# Altium project STM32-MiniPi.PrjPcb
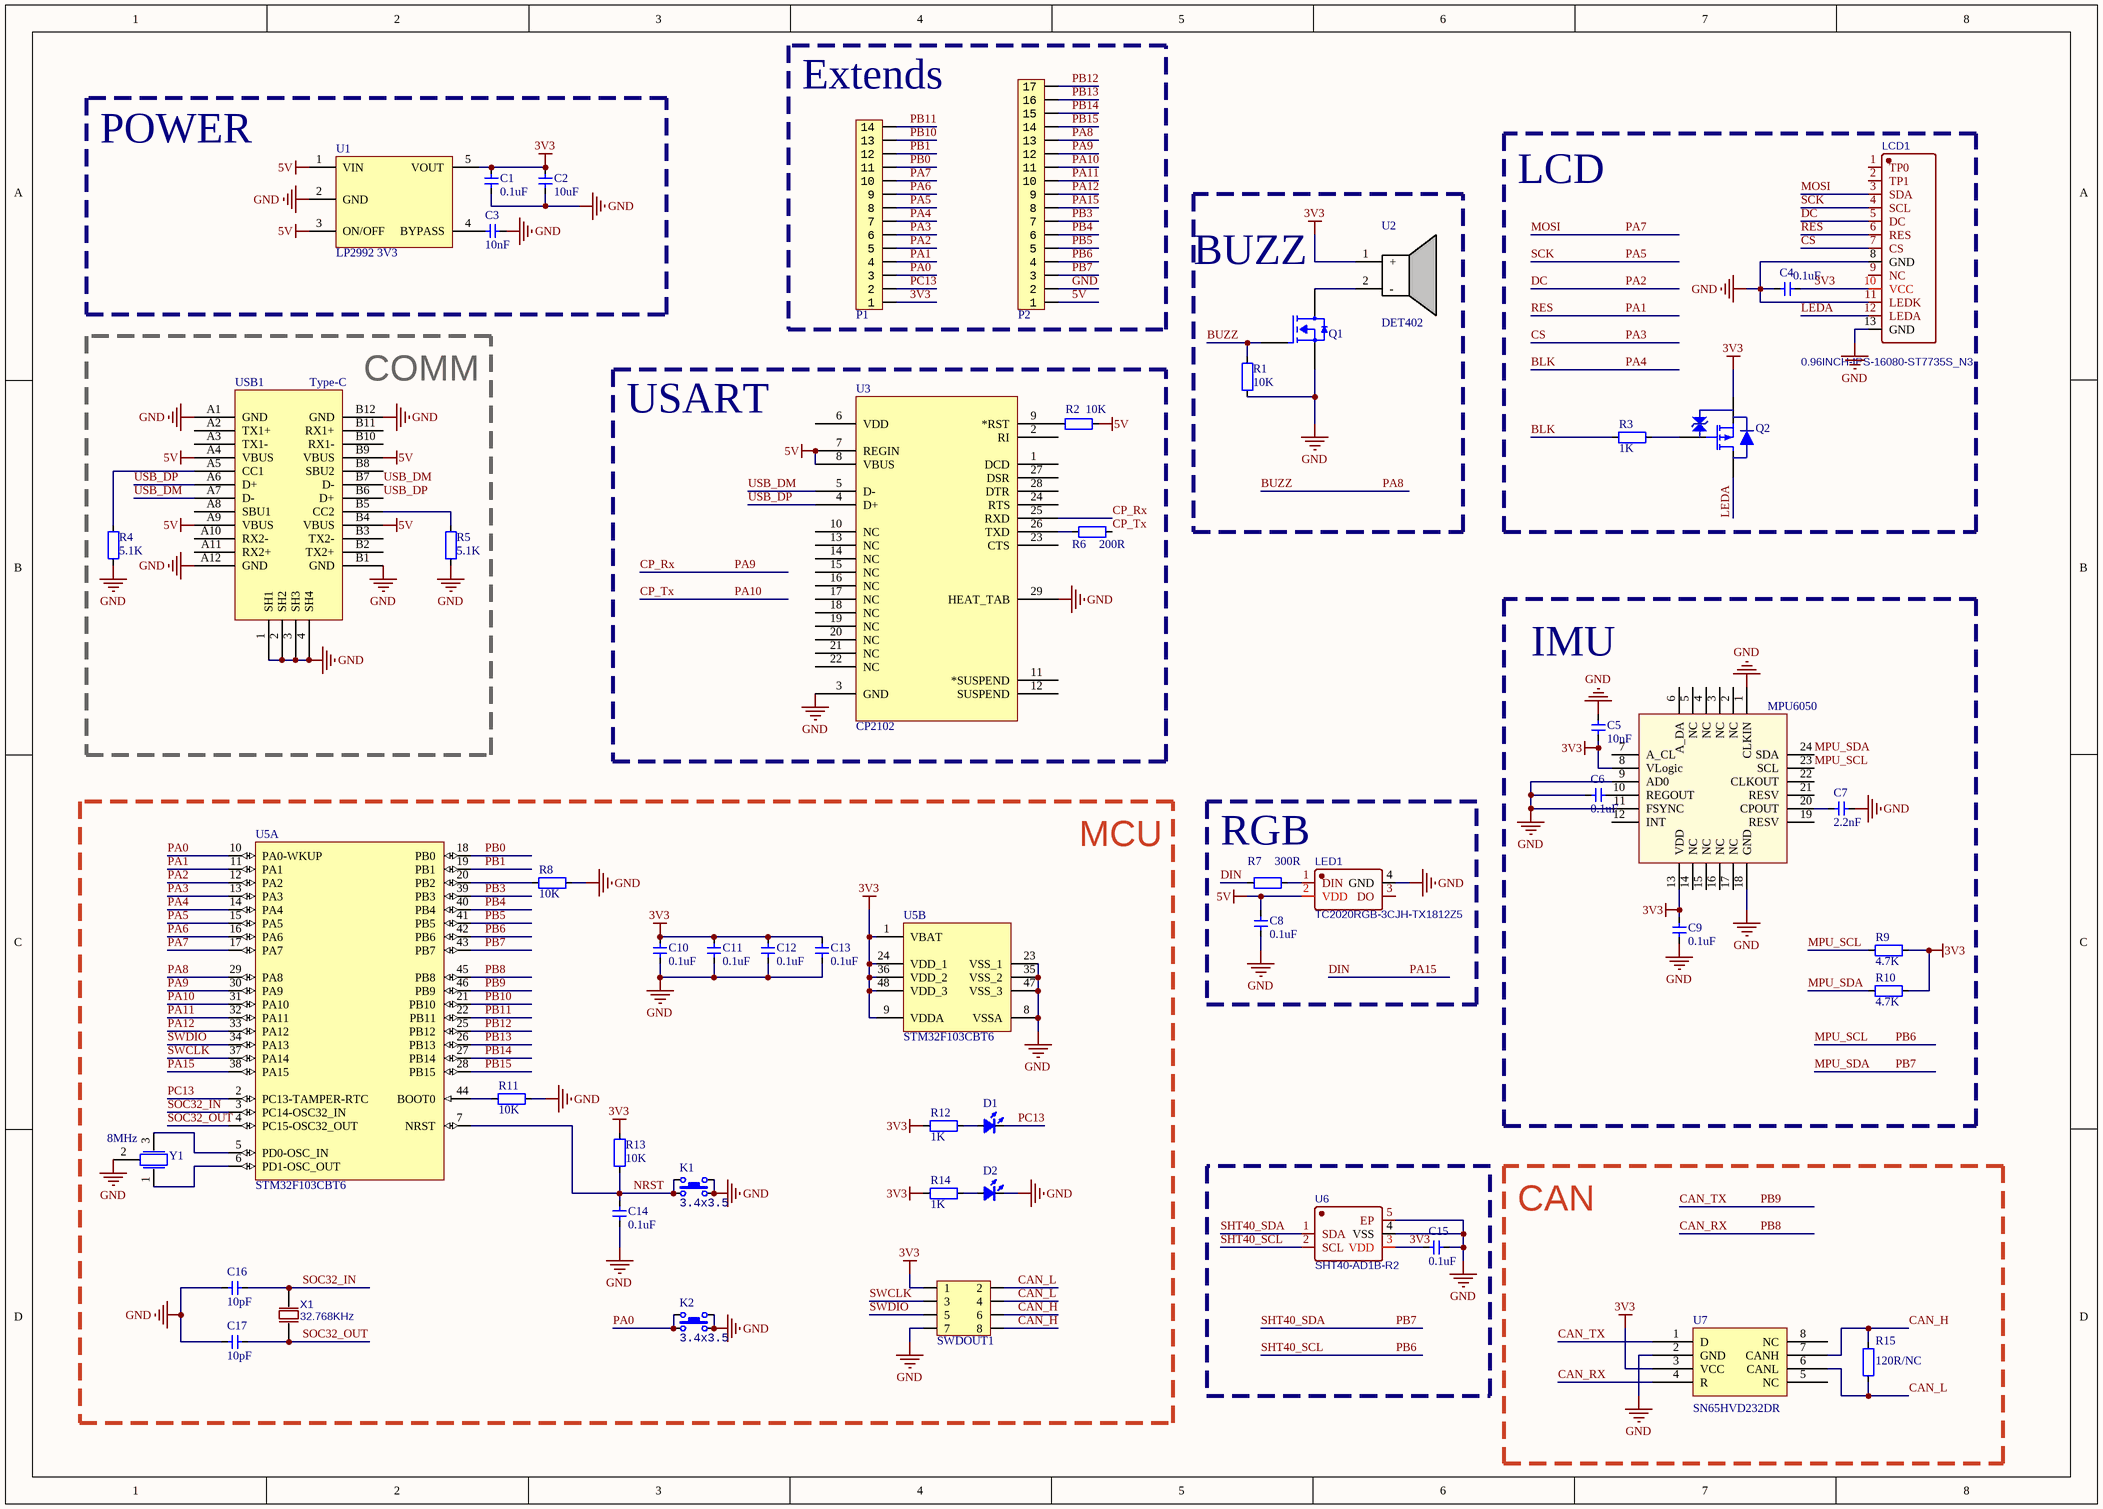
[diagram p0: Main.SchDoc]
1 sheet, 53 parts. Net scope: global (net labels, ports and power ports of the same name join across sheets).
Board file: STM32-MiniPi.PcbDoc

## Sheet Main.SchDoc
size A3; SheetNumber: 1; SheetTotal: 1

### Parts
C1  0.1uF  [CAP_0402]
C2  10uF  [CAP_0402]
C3  10nF  [CAP_0402]
C4  0.1uF  [CAP_0402]
C5  10nF  [CAP_0402]
C6  0.1uF  [CAP_0402]
C7  2.2nF  [CAP_0402]
C8  0.1uF  [CAP_0402]
C9  0.1uF  [CAP_0402]
C10  0.1uF  [CAP_0402]
C11  0.1uF  [CAP_0402]
C12  0.1uF  [CAP_0402]
C13  0.1uF  [CAP_0402]
C14  0.1uF  [CAP_0402]
C15  0.1uF  [CAP_0402]
C16  10pF  [CAP_0402]
C17  10pF  [CAP_0402]
D1  color?  [LED_0402_RED]  (value not drawn)
D2  color?  [LED_0402_RED]  (value not drawn)
K1  value 3.4x3.5  [ButtonTACT_3.5*3.55_90]  (hidden comment: TACT 4P)
K2  value 3.4x3.5  [ButtonTACT_3.5*3.55_90]  (hidden comment: TACT 4P)
LCD1  0.96INCH-IPS-16080-ST7735S_N3  [LCD-0.96INCH-IPS-TFT-16080-ST7735S]
LED1  TC2020RGB-3CJH-TX1812Z5  [LED-SMD_4P-L2.1-W2.1-TL_TC2020RGB]
P1  HDR1x14_2.54  [HDR1X14_2.54_180]  (value not drawn)
P2  HDR1x17_2.54  [HDR1X17_2.54_180]  (value not drawn)
Q1  AO3400A  [SOT23-3]  (value not drawn)
Q2  AO3415A  [SOT23-3]  (value not drawn)
R1  10K  [RES_0402]
R2  10K  [RES_0402]
R3  1K  [RES_0402]
R4  5.1K  [RES_0402]
R5  5.1K  [RES_0402]
R6  200R  [RES_0402]
R7  300R  [RES_0402]
R8  10K  [RES_0402]
R9  4.7K  [RES_0402]
R10  4.7K  [RES_0402]
R11  10K  [RES_0402]
R12  1K  [RES_0402]
R13  10K  [RES_0402]
R14  1K  [RES_0402]
R15  120R/NC  [RES_0402]
SWDOUT1  HDR2x4_2.54  [HDR2X4_2.54_180H]  (value not drawn)
U1  LP2992 3V3  [SOT23-5]
U2  DET402  [DET402]
U3  CP2102  [QFN-28]
U4  MPU6050  [QFN-24]
U5  STM32F103CBT6  [LQFP-48]  (parts A,B of 2)
U6  SHT40-AD1B-R2  [DFN-4_L1.5-W1.5-P0.8]
U7  Manufacturer Part Number: SN65HVD232DR  [SO-8]  (hidden comment: SN65HVD232D)
USB1  Type-C  [Type-C-TOP]
X1  32.768KHz  [OSC-SMD_L3.2-W1.5]
Y1  8MHz  [晶振-3P]

### Blocks framed on the sheet
Extends: P1 P2
POWER: C1-C3 U1
BUZZ: Q1 R1 U2
COMM: R4 R5 USB1
USART: R2 R6 U3
IMU: C5-C7 C9 R9 R10 U4
MCU: C10-C14 C16 C17 D1 D2 K1 K2 R8 R11-R14 SWDOUT1 U5 X1 Y1
RGB: C8 LED1 R7
CAN: R15 U7

### Nets
3V3: C1.2 C2.2 C4.1 C5.1 C9.2 C10.2 C11.2 C12.2 C13.2 C15.2 LCD1.10(VCC) P1.1 Q2.2(S) R9.2 R10.2 R12.1 R13.2 R14.1 SWDOUT1.1 U1.5(VOUT) U2.1(+) U4.8(VLogic) U4.13(VDD) U5.1(VBAT) U5.9(VDDA) U5.24(VDD_1) U5.36(VDD_2) U5.48(VDD_3) U6.3(VDD) U7.3(VCC)
5V: C8.1 LED1.2(VDD) P2.1 R2.1 U1.1(VIN) U1.3(ON/OFF) U3.7(REGIN) U3.8(VBUS) USB1.A4(VBUS) USB1.A9(VBUS) USB1.B4(VBUS) USB1.B9(VBUS)
GND: C1.1 C2.1 C3.1 C4.2 C5.2 C6.2 C7.1 C8.2 C9.1 C10.1 C11.1 C12.1 C13.1 C14.1 C15.1 C16.2 C17.2 D2.2(K) K1.2 K1.4 K2.2 K2.4 LCD1.8(GND) LCD1.11(LEDK) LCD1.13(GND) LED1.4(GND) P2.2 Q1.2(S) R1.1 R4.2 R5.2 R8.1 R11.1 SWDOUT1.7 U1.2(GND) U3.3(GND) U3.29(HEAT_TAB) U4.1(CLKIN) U4.9(AD0) U4.11(FSYNC) U4.18(GND) U5.8(VSSA) U5.23(VSS_1) U5.35(VSS_2) U5.47(VSS_3) U6.4(VSS) U6.5(EP) U7.2(GND) USB1.1(SH1) USB1.2(SH2) USB1.3(SH3) USB1.4(SH4) USB1.A1(GND) USB1.A12(GND) USB1.B1(GND) USB1.B12(GND) Y1.2
BLK: P1.7 R3.1 U5.14(PA4)  [also labelled PA4]
BUZZ: P2.13 Q1.1(G) R1.2 U5.29(PA8)  [also labelled PA8]
CAN_H: R15.1 SWDOUT1.6 SWDOUT1.8 U7.7(CANH)
CAN_L: R15.2 SWDOUT1.2 SWDOUT1.4 U7.6(CANL)
CAN_RX: U5.45(PB8) U7.4(R)  [also labelled PB8]
CAN_TX: U5.46(PB9) U7.1(D)  [also labelled PB9]
CP_Rx: P2.12 U3.25(RXD) U5.30(PA9)  [also labelled PA9]
CP_Tx: P2.11 R6.1 U5.31(PA10)  [also labelled PA10]
CS: LCD1.7(CS) P1.6 U5.13(PA3)  [also labelled PA3]
DC: LCD1.5(DC) P1.5 U5.12(PA2)  [also labelled PA2]
DIN: P2.8 R7.2 U5.38(PA15)  [also labelled PA15]
LEDA: LCD1.12(LEDA) Q2.3(D)
MOSI: LCD1.3(SDA) P1.10 U5.17(PA7)  [also labelled PA7]
MPU_SCL: P2.4 R9.1 U4.23(SCL) U5.42(PB6) U6.2(SCL)  [also labelled PB6, SHT40_SCL]
MPU_SDA: P2.3 R10.1 U4.24(SDA) U5.43(PB7) U6.1(SDA)  [also labelled PB7, SHT40_SDA]
NRST: C14.2 K1.1 K1.3 R13.1 U5.7(NRST)
PA0: K2.1 K2.3 P1.3 U5.10(PA0-WKUP)
PA1: LCD1.6(RES) P1.4 U5.11(PA1)  [also labelled RES]
PA5: LCD1.4(SCL) P1.8 U5.15(PA5)  [also labelled SCK]
PA6: P1.9 U5.16(PA6)
PA11: P2.10 U5.32(PA11)
PA12: P2.9 U5.33(PA12)
PB0: P1.11 U5.18(PB0)
PB1: P1.12 U5.19(PB1)
PB3: P2.7 U5.39(PB3)
PB4: P2.6 U5.40(PB4)
PB5: P2.5 U5.41(PB5)
PB10: P1.13 U5.21(PB10)
PB11: P1.14 U5.22(PB11)
PB12: P2.17 U5.25(PB12)
PB13: P2.16 U5.26(PB13)
PB14: P2.15 U5.27(PB14)
PB15: P2.14 U5.28(PB15)
PC13: D1.2(K) P1.2 U5.2(PC13-TAMPER-RTC)
SOC32_IN: C16.1 U5.3(PC14-OSC32_IN) X1.2(OSC2)
SOC32_OUT: C17.1 U5.4(PC15-OSC32_OUT) X1.1(OSC1)
SWCLK: SWDOUT1.3 U5.37(PA14)
SWDIO: SWDOUT1.5 U5.34(PA13)
USB_DM: U3.5(D-) USB1.A7(D-) USB1.B7(D-)
USB_DP: U3.4(D+) USB1.A6(D+) USB1.B6(D+)
NetC3_2: C3.2 U1.4(BYPASS)
NetC6_1: C6.1 U4.10(REGOUT)
NetC7_2: C7.2 U4.20(CPOUT)
NetD1_1: D1.1(A) R12.2
NetD2_1: D2.1(A) R14.2
NetLED1_1: LED1.1(DIN) R7.1
NetQ1_3: Q1.3(D) U2.2(-)
NetQ2_1: Q2.1(G) R3.2
NetR2_2: R2.2 U3.9(*RST)
NetR4_1: R4.1 USB1.A5(CC1)
NetR5_1: R5.1 USB1.B5(CC2)
NetR6_2: R6.2 U3.26(TXD)
NetR8_2: R8.2 U5.20(PB2)
NetR11_2: R11.2 U5.44(BOOT0)
NetU5_5: U5.5(PD0-OSC_IN) Y1.3
NetU5_6: U5.6(PD1-OSC_OUT) Y1.1

Not connected (* = marked no-connect by the designer): LCD1 1(TP0) 2(TP1) 9(NC); LED1 3(DO); U3 1(DCD) 2(RI) 6(VDD) 10(NC) 11(*SUSPEND) 12(SUSPEND) 13(NC) 14(NC) 15(NC) 16(NC) 17(NC) 18(NC) 19(NC) 20(NC) 21(NC) 22(NC) 23(CTS) 24(RTS) 27(DSR) 28(DTR); U4 2(NC) 3(NC) 4(NC) 5(NC) 6(A_DA) 7(A_CL) 12(INT) 14(NC) 15(NC) 16(NC) 17(NC) 19(RESV) 21(RESV) 22(CLKOUT); U7 5(NC) 8(NC); USB1 A2(TX1+) A3(TX1-) A8(SBU1) A10(RX2-) A11(RX2+) B2(TX2+) B3(TX2-) B8(SBU2) B10(RX1-) B11(RX1+)

### Notes on the sheet
- LCD

### Library data of the parts
C1-C17 = 电容-0402: Capacitor; Value: 0.1u
D1 D2 = LED_0402: LED; Type: 0402; Value: color?
K1 K2 = ButtonTACT: Button; type: TACT 4P
LCD1 = 0.96INCH-IPS-16080-ST7735S_N3: Contributor: micespring; spicePre: L; spiceSymbolName: 0.96INCH-IPS-16080-ST7735S_N3
LED1 = TC2020RGB-3CJH-TX1812Z5: BOM_Manufacturer: TCWIN; Contributor: LCSC; BOM_Supplier: LCSC; BOM_Supplier Part: C784564; BOM_Manufacturer Part: TC2020RGB-3CJH-TX1812Z5; BOM_JLCPCB Part Class: Extended Part; spicePre: L; spiceSymbolName: TC2020RGB-3CJH-TX1812Z5
P1 = HDR1x14_2.54: Header
P2 = HDR1x17_2.54: Header
Q1 = AO3400A: N-MOS
Q2 = AO3415A: MOSFET; Published: 8-Jun-2000; LatestRevisionDate: 17-Jul-2002; LatestRevisionNote: Re-released for DXP Platform.; PackageVersion: 1995/1996; PackageReference: E3; Publisher: Altium Limited; PackageDescription: TO, Flat Index; 3 In-Line, Axial Leads; Body Dia. 4.6mm; Lead Dia. 0.5 mm (max)
R1-R15 = 电阻-0402: Resistor; Value: 22R
SWDOUT1 = HDR2x4_2.54: Header
U1 = LP2992: LDO
U3 = CP2102: USB转TTL; PART DESC: SINGLE-CHIP USB TO UART BRIDGE, QFN28, RoHS.; MFG #1: SILICON LABS; PART NUMBER: CP2102; Value: Value; RefDes: RefDes; Type: DEV
U4 = MPU6050: 六轴传感器
U5 = STM32F103CBT6: ARM Cortex-M3 32-bit MCU, 128 KB Flash, 20 KB Internal RAM, 37 I/Os, 48-pin LQFP, -40 to 85 degC, Tray; A/D Converter: 2x12-bit (10 Channel); FLASH Size (Prog) (kB): 128; I/Os (High Current): 37; Internal RAM Size (kB): 20; Operating Frequency(F) (Processor speed) (MHz): 72; Supply Voltage(Vcc) min (V): 2; DatasheetVersion: Rev. 16; PackageVersion: Rev. 6, 06/2013; PackageReference: LQFP48; PackageDescription: 48-Pin Low Profile Quad Flat Package, 7 x 7 mm Body, 0.5 mm Pitch; Supplier 1: Digi-Key; Supplier Part Number 1: 497-6288-ND; Supplier 2: Farnell; Supplier Part Number 2: 1606327; Supplier 3: Newark; Supplier Part Number 3: 11N8296; Supplier 4: Newark; Supplier Part Number 4: 57P1214; Supplier 5: Mouser; Supplier Part Number 5: 511-STM32F103CBT6; Core: ARM Cortex-M3; Packing: Tray; Mounting Technology: Surface Mount; PartNumber: STM32F103CBT6; ComponentLink1Description: Manufacturer URL; ComponentLink1URL: http://www.st.com/web/en/home.html; ComponentLink2Description: Datasheet; ComponentLink2URL: http://www.st.com/st-web-ui/static/active/en/resource/technical/document/datasheet/CD00161566.pdf; ComponentLink3Description: Package Specification; ComponentLink3URL: http://www.st.com/st-web-ui/static/active/en/resource/technical/document/datasheet/DM00058181.pdf
U6 = SHT40-AD1B-R2: BOM_Manufacturer: Sensirion(瑞士盛思锐); Contributor: LCSC; BOM_Supplier: LCSC; BOM_Supplier Part: C2909890; BOM_Manufacturer Part: SHT40-AD1B-R2; BOM_JLCPCB Part Class: Extended Part; spicePre: U; spiceSymbolName: SHT40-AD1B-R2
U7 = SN65HVD232D: Manufacturer: Texas Instruments; Protocol: CAN; Number of Drivers/Receivers: 1/1; Duplex: Half; Data Rate: 1Mbps; Voltage - Supply: 3 V ~ 3.6 V; Supplier 1: Digi-Key; Supplier Part Number 1: 296-26344-2-ND; RoHS: RoHS Compliant; Category: Integrated Circuits (ICs); Stock: 5000; Pricing 1: 2500=0.84375 (USD); Packaging: Tape & Reel (TR); Part Status: Active; Type: Transceiver; Operating Temperature: -40°C ~ 85°C; Mounting Type: Surface Mount; Package / Case: 8-SOIC (0.154", 3.90mm Width); Supplier Device Package: 8-SOIC; ComponentLink1URL: http://www.ti.com/lit/ds/symlink/sn65hvd230.pdf; ComponentLink1Description: http://www.ti.com/lit/ds/symlink/sn65hvd230.pdf; Supplier 2: Digi-Key; Supplier Part Number 2: 296-26344-1-ND; Pricing 2: 1=2.05, 10=1.842, 100=1.4809, 500=1.21668, 1000=1.00811 (USD)
USB1 = USB-Type-C-TOP
X1 = 32.768KHz: BOM_Manufacturer: Nihon Dempa Kogyo; BOM_Manufacturer Part: EXS00A-MU00202; nameAlias: Frequency; Contributor: LCSC; BOM_Supplier: LCSC; BOM_Supplier Part: C280830; spicePre: X; spiceSymbolName: EXS00A-MU00202
Y1 = 晶振-3Pin: 村田贴片